# EAGLE design ntp_clock_stand (EAGLE 7.2.0)
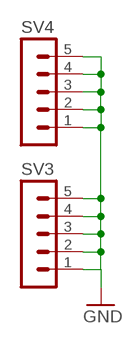
[diagram p0: schematic, sheet 1]

## Parts
SV3  MA05-1  [MA05-1]
SV4  MA05-1  [MA05-1]

## Nets
GND: SV3.1 SV3.2 SV3.3 SV3.4 SV3.5 SV4.1 SV4.2 SV4.3 SV4.4 SV4.5

## Library data of the parts
SV3 SV4 = con-lstb:MA05-1: PIN HEADER; OC_FARNELL: unknown; OC_NEWARK: unknown

## Net classes
1 power: width 0.254 mm

## Board
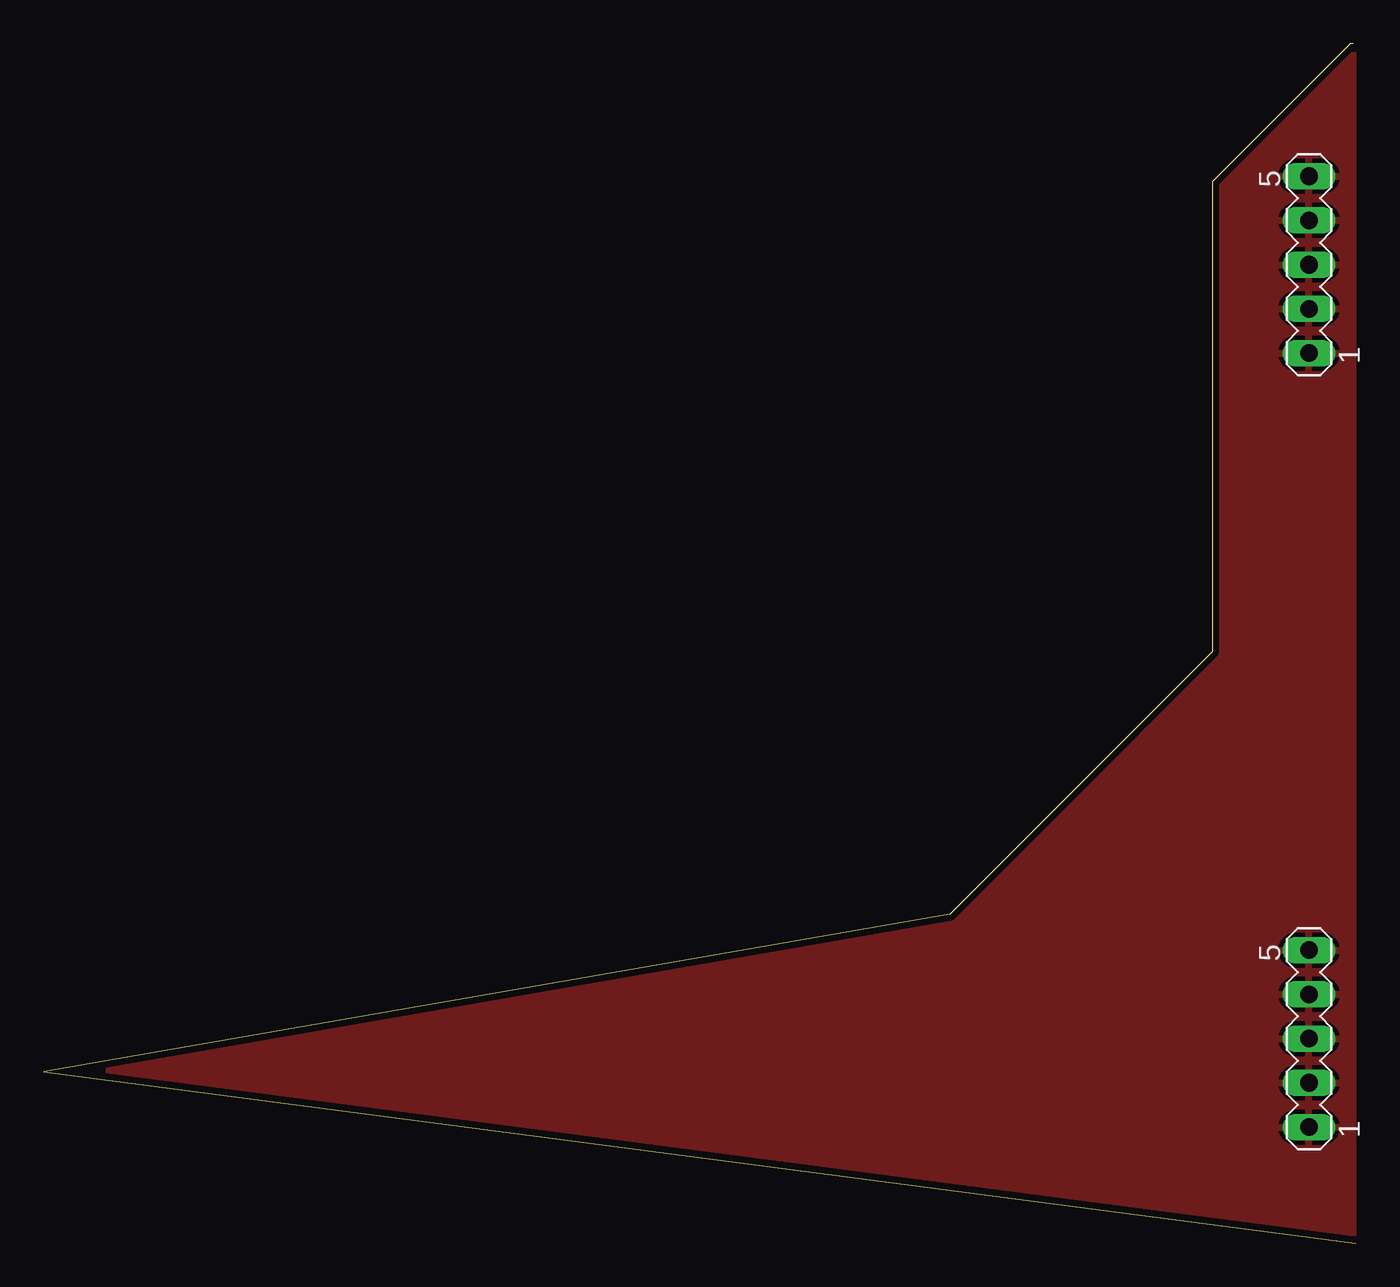
[diagram p1: board, top side]
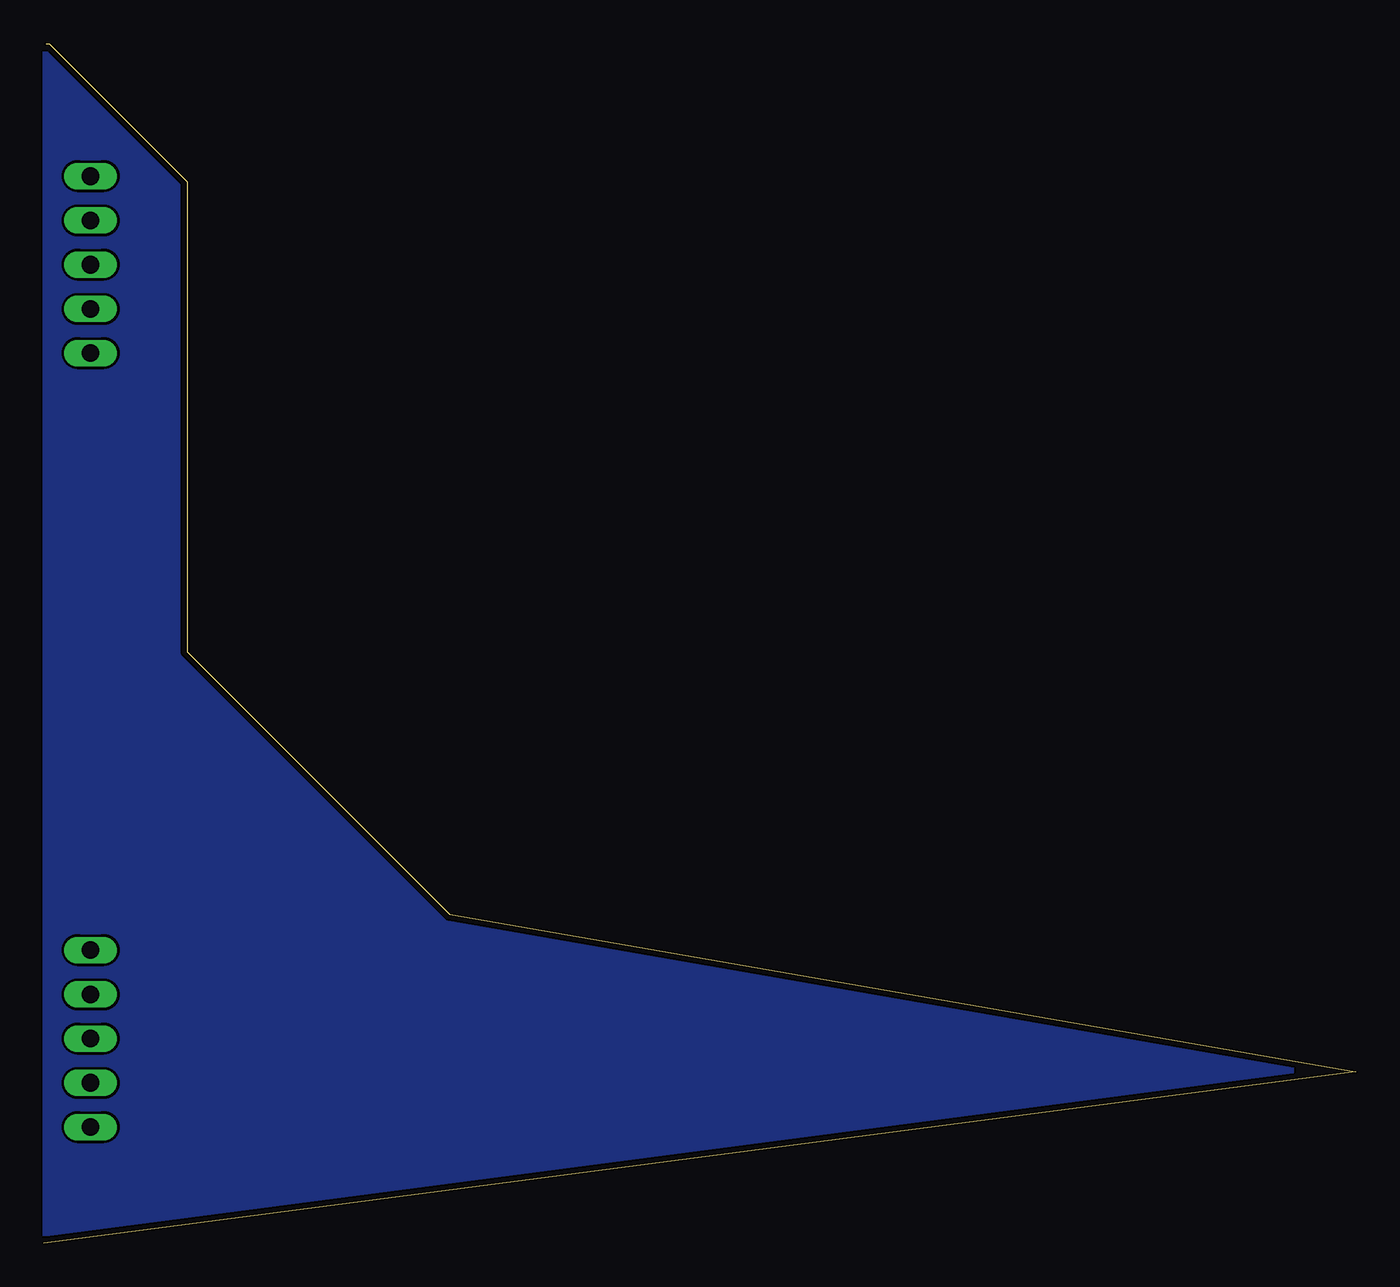
[diagram p2: board, bottom side, seen from below]

Size 75.41 x 68.9 mm. Coordinates in mm from the lower left corner, seen from the top.
Outline: 75.41,0 0,9.84 52.07,18.89 67.15,33.97 67.15,60.96 75.09,68.9 75.25,68.9
Copper layers (1*16): Top 0.0356mm / dielectric 1.5011mm / Bottom 0.0356mm
Design rules "LaenPCBOrder": minimum track width 6mil, minimum drill 13mil, track to track 6mil, track to pad 6mil, pad to pad 6mil, via to via 6mil, smd to smd 6mil, copper to edge 15mil, drill to drill 6mil, minimum pad ring 7mil, minimum via ring 7mil, stop-mask expansion 3mil, vias tented up to drill 0mil, thermal gap 10mil

### Footprints (pad centres in the part's own frame; a part is rotated, then mirrored left to right if it is on the bottom)
MA05-1 = drill 1.016 long: 1 -5.08,0; 2 -2.54,0; 3 0,0; 4 2.54,0; 5 5.08,0

### Placement (x,y rotation side)
SV3  72.71,56.2 90 top
SV4  72.71,11.75 90 top

### Tracks (layer width: path | path; a pad name or v marks a point on that pad's centre or on a via)
5V
  pour Bottom: 0,9.84 75.25,0 75.25,68.9 75.09,68.9 67.15,60.96 67.15,33.97 52.07,18.89
GND
  pour Top: 0,9.84 75.25,0 75.25,68.9 75.09,68.9 67.15,60.96 67.15,33.97 52.07,18.89